# Altium schematic sheet 12V Input Circuitry.SchDoc
size A4
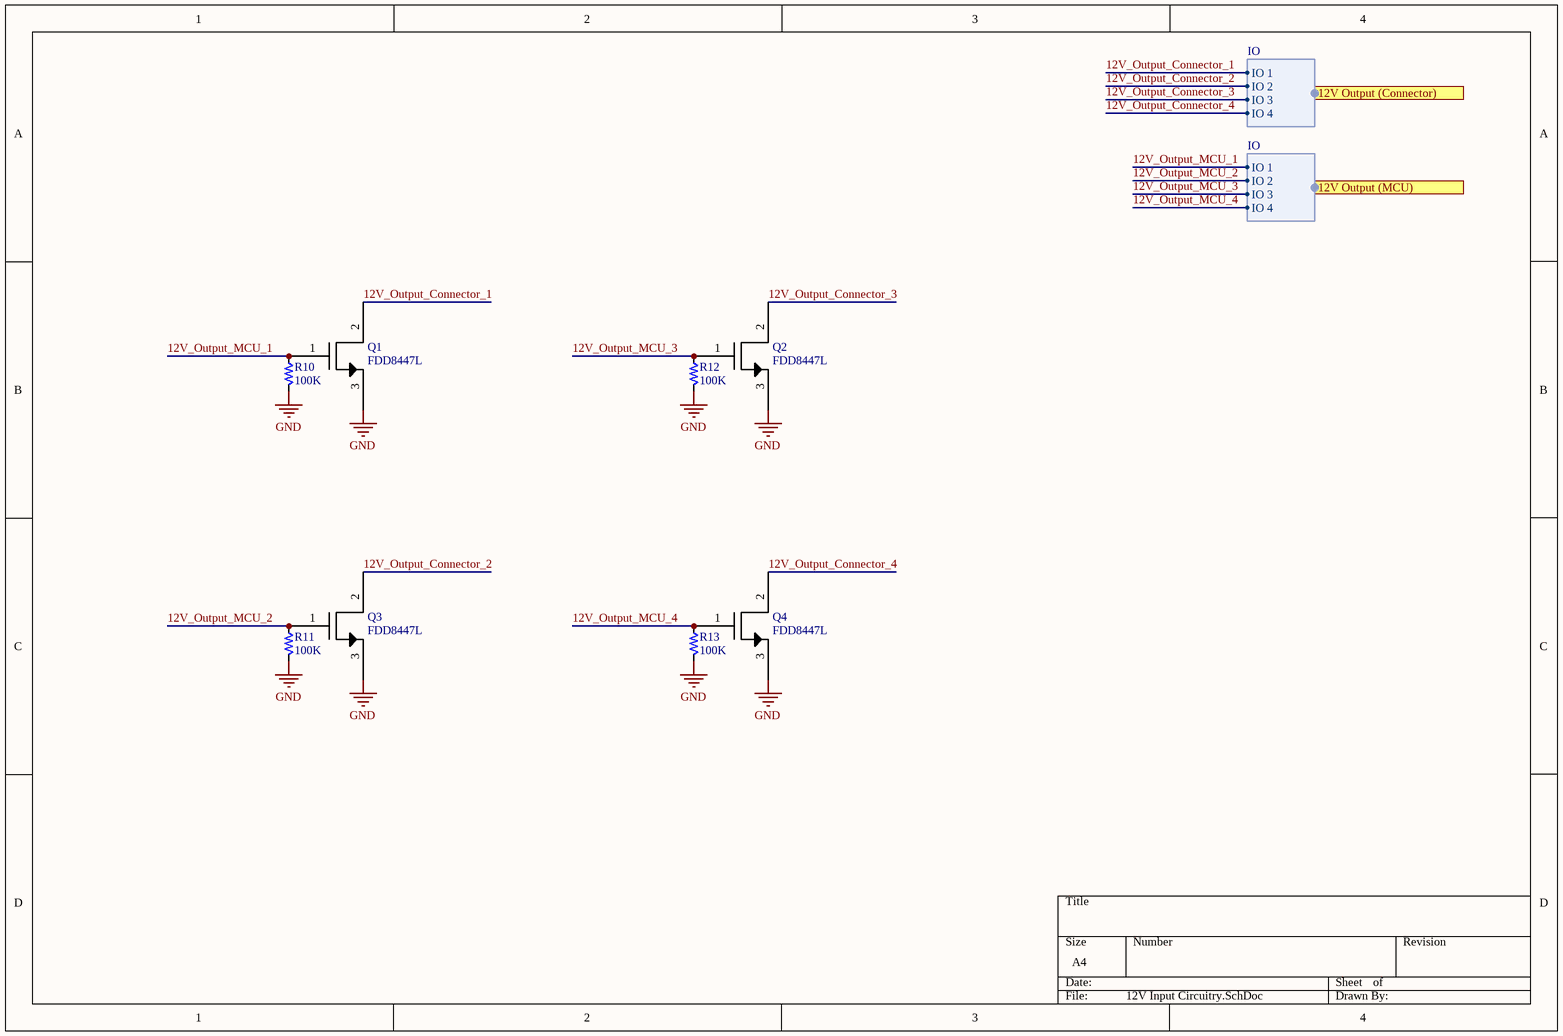
[diagram p0: 12V Input Circuitry.SchDoc]

## Parts
Q1  FDD8447L  [FDD8447L]
Q2  FDD8447L  [FDD8447L]
Q3  FDD8447L  [FDD8447L]
Q4  FDD8447L  [FDD8447L]
R10  Resistance: 100K  [PCB_GENERIC_SMD_0603]  (hidden comment: SCH_GENERIC_RESISTOR_0603)
R11  Resistance: 100K  [PCB_GENERIC_SMD_0603]  (hidden comment: SCH_GENERIC_RESISTOR_0603)
R12  Resistance: 100K  [PCB_GENERIC_SMD_0603]  (hidden comment: SCH_GENERIC_RESISTOR_0603)
R13  Resistance: 100K  [PCB_GENERIC_SMD_0603]  (hidden comment: SCH_GENERIC_RESISTOR_0603)

## Ports
12V Output (Connector) (harness IO), 12V Output (MCU) (harness IO)

## Harnesses
IO: IO 1, IO 2, IO 3, IO 4

## Nets
GND: Q1.3 Q2.3 Q3.3 Q4.3 R10.2 R11.2 R12.2 R13.2
12V_Output_Connector_1: Q1.2 ; port 12V Output (Connector).IO 1
12V_Output_Connector_2: Q3.2 ; port 12V Output (Connector).IO 2
12V_Output_Connector_3: Q2.2 ; port 12V Output (Connector).IO 3
12V_Output_Connector_4: Q4.2 ; port 12V Output (Connector).IO 4
12V_Output_MCU_1: Q1.1 R10.1 ; port 12V Output (MCU).IO 1
12V_Output_MCU_2: Q3.1 R11.1 ; port 12V Output (MCU).IO 2
12V_Output_MCU_3: Q2.1 R12.1 ; port 12V Output (MCU).IO 3
12V_Output_MCU_4: Q4.1 R13.1 ; port 12V Output (MCU).IO 4

## Library data of the parts
Q1-Q4 = NMOS
R10-R13 = SCH_GENERIC_RESISTOR_0603: Generic SMD resistor 0603